# Altium project CP2102_USB-TO-UART.PrjPcb
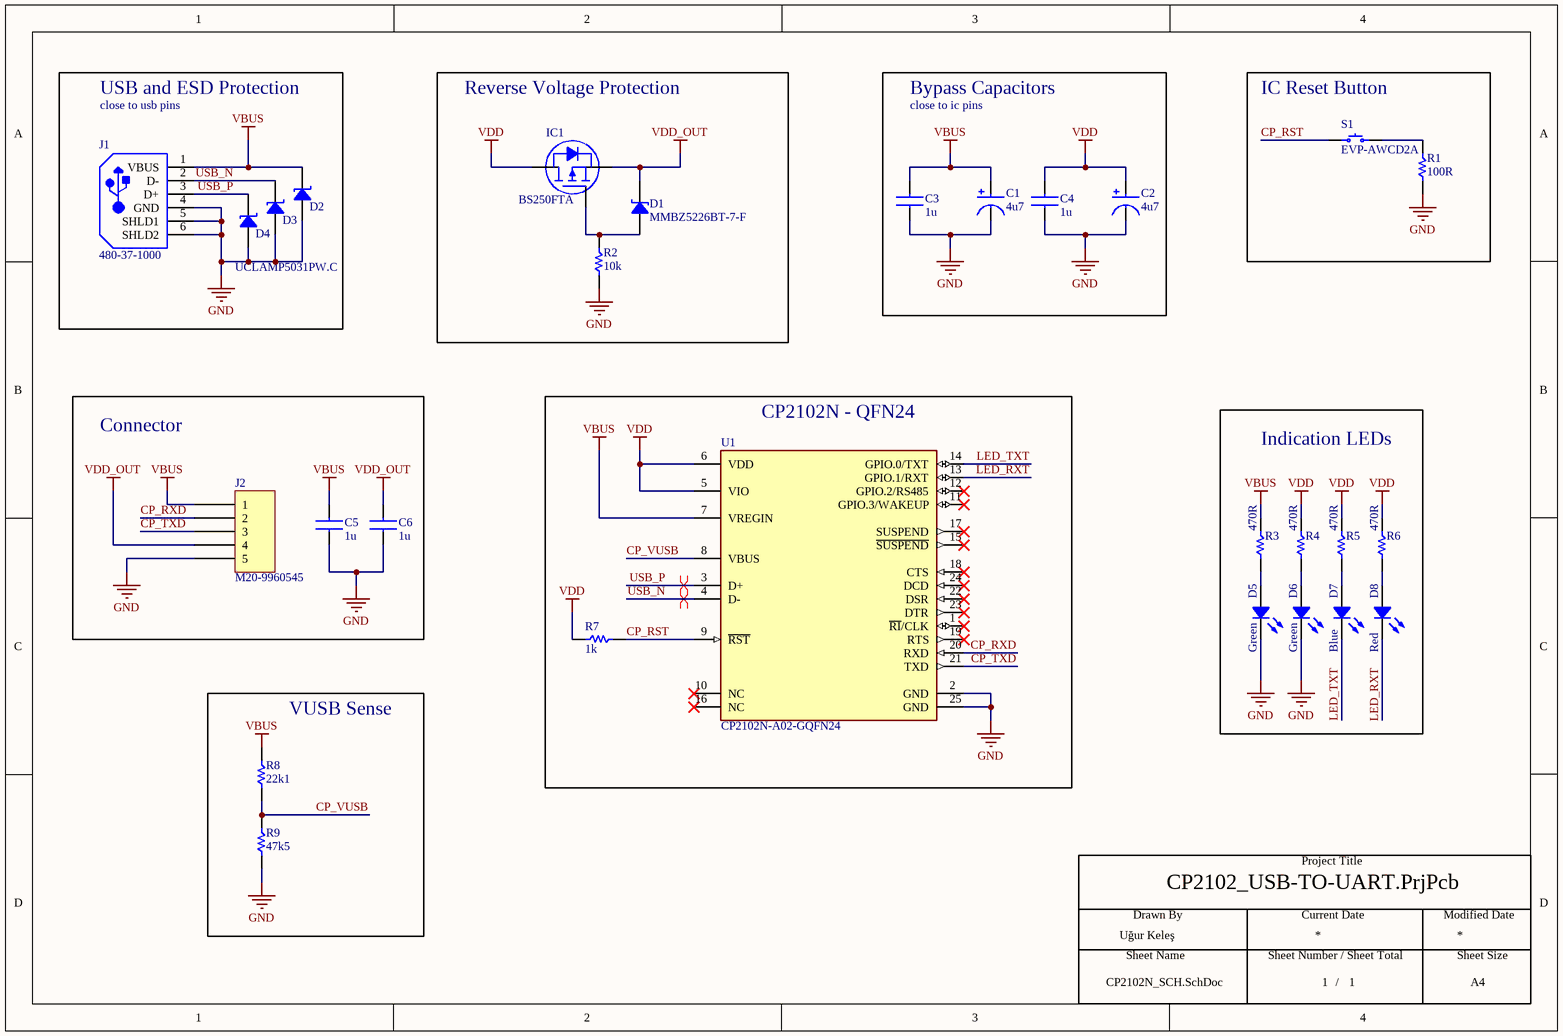
[diagram p0: CP2102N_SCH.SchDoc]
1 sheet, 28 parts. Net scope: global (net labels, ports and power ports of the same name join across sheets).
Board file: CP2102N_PCB.PcbDoc

## Sheet CP2102N_SCH.SchDoc
size A4; DrawnBy: Uğur Keleş; SheetNumber: 1; SheetTotal: 1; Size: A4

### Parts
C1  4u7  [CAP TANT 0805]
C2  4u7  [CAP TANT 0805]
C3  1u  [CAP CER 0402]
C4  1u  [CAP CER 0402]
C5  1u  [CAP CER 0402]
C6  1u  [CAP CER 0402]
D1  MMBZ5226BT-7-F  [DIODES SOT-523]
D2  UCLAMP5031PW.C  [0402]  (value not drawn)
D3  UCLAMP5031PW.C  [0402]  (value not drawn)
D4  UCLAMP5031PW.C  [0402]
D5  Green  [LED 0402_1005 GREEN]
D6  Green  [LED 0402_1005 GREEN]
D7  Blue  [LED 0402_1005 BLUE]
D8  Red  [LED 0402_1005 RED]
IC1  BS250FTA  [DIODES SOT-23-3]
J1  480-37-1000  [MOLX-480-37-1000_V]
J2  M20-9960545  [HARWIN M20-9960545]
R1  100R  [Resistor 0402]
R2  10k  [Resistor 0402]
R3  470R  [Resistor 0402]
R4  470R  [Resistor 0402]
R5  470R  [Resistor 0402]
R6  470R  [Resistor 0402]
R7  1k  [Resistor 0402]
R8  22k1  [Resistor 0402]
R9  47k5  [Resistor 0402]
S1  EVP-AWCD2A  [PANASONIC EVPAW]
U1  CP2102N-A02-GQFN24  [FP-CP2102N-A02-GQFN24-MFG]

### Blocks framed on the sheet
USB and ESD Protection: D2-D4 J1
Reverse Voltage Protection: D1 IC1 R2
Bypass Capacitors: C1-C4
IC Reset Button: R1 S1
Connector: C5 C6 J2
CP2102N - QFN24: R7 U1
Indication LEDs: D5-D8 R3-R6
VUSB Sense: R8 R9

### Nets
GND: C1.2 C2.2 C3.1 C4.1 C5.1 C6.1 D2.1 D3.1 D4.1 D5.2 D6.2 J1.4(GND) J1.5(SHLD1) J1.6(SHLD2) J2.5 R1.1 R2.1 R9.1 U1.2(GND) U1.25(GND)
VBUS: C1.1 C3.2 C5.2 D2.2 J1.1(VBUS) J2.1 R3.2 R8.2 U1.7(VREGIN)
VDD: C2.1 C4.2 IC1.3(D) R4.2 R5.2 R6.2 R7.1 U1.5(VIO) U1.6(VDD)
VDD_OUT: C6.2 D1.2 IC1.2(S) J2.4
CP_RST: R7.2 S1.1 U1.9(~{RST})
CP_RXD: J2.2 U1.20(RXD)
CP_TXD: J2.3 U1.21(TXD)
CP_VUSB: R8.1 R9.2 U1.8(VBUS)
LED_RXT: D8.2 U1.13(GPIO.1/RXT)
LED_TXT: D7.2 U1.14(GPIO.0/TXT)
USB_N: D3.2 J1.2(D-) U1.4(D-)
USB_P: D4.2 J1.3(D+) U1.3(D+)
NetD1_1: D1.1 IC1.1(G) R2.2
NetD5_1: D5.1 R3.1
NetD6_1: D6.1 R4.1
NetD7_1: D7.1 R5.1
NetD8_1: D8.1 R6.1
NetR1_2: R1.2 S1.2

Not connected (* = marked no-connect by the designer): U1 1(~{RI}/CLK)* 10(NC)* 11(GPIO.3/WAKEUP)* 12(GPIO.2/RS485)* 15(~{SUSPEND})* 16(NC)* 17(SUSPEND)* 18(CTS)* 19(RTS)* 22(DSR)* 23(DTR)* 24(DCD)*

### Layout directives
differential pair: USB_N, USB_P

### Notes on the sheet
- close to usb pins
- close to ic pins
- Drawn By
- Project Title
- Current Date
- Modified Date
- Sheet Name
- Sheet Number / Sheet Total
- /
- Sheet Size

### Library data of the parts
C1 C2 = CAP TANT GENERIC 0805: Designed by: UK; Value: 4u7
C3-C6 = CAP CER GENERIC 0402: Designed by: UK; Value: 1u
D1 = MMBZ5226BT-7-F: DIODE ZENER 3.3V 150MW SOT523; Manufacturer: Diodes Incorporated; Current - Reverse Leakage @ Vr: 25 µA @ 1 V; Impedance (Max) (Zzt): 28 Ohms; Tolerance: ±5%; Voltage - Forward (Vf) (Max) @ If: 900 mV @ 10 mA; Part Number: MMBZ5226BT-7-F; ComponentLink1Description: Datasheet; ComponentLink1URL: https://www.diodes.com/assets/Datasheets/ds30267.pdf; ComponentLink2Description: DigiKey Link; ComponentLink2URL: https://www.digikey.com/en/products/detail/diodes-incorporated/MMBZ5226BT-7-F/2095654; LastUpdated: 6/3/2024 8:01:51 PM; Lifecycle Status: Active; Minimum Order: 1; Mounting Type: Surface Mount; Operating Temperature: -65°C ~ 150°C; Package / Case: SOT-523; Packaging: TapeAndReel; PartId: 790; Part Status: Active; Power - Max: 150 mW; Price: 0.05; Series: -; Supplier 1: DigiKey; Supplier Part Number 1: MMBZ5226BTDICT-ND; Supplier Device Package: SOT-523; Voltage - Zener (Nom) (Vz): 3.3 V
D2-D4 = UCLAMP5031PW.C: 5V ESD & EOS PROTECTION; Manufacturer: Semtech Corporation; Power Line Protection: No; Type: Zener; Unidirectional Channels: 1; Part Number: UCLAMP5031PW.C; Applications: General Purpose; ComponentLink2Description: DigiKey Link; ComponentLink2URL: https://www.digikey.com/en/products/detail/semtech-corporation/UCLAMP5031PW-C/21371847; Device Package: 0402 (1005 Metric); LastUpdated: 6/3/2024 8:22:49 PM; Lifecycle Status: Active; Minimum Order: 1; Mounting Type: Surface Mount; Package / Case: 0402 (1005 Metric); Packaging: TapeAndReel; PartId: 11945; Price: 0.08; Series: uClamp®; Supplier 1: DigiKey; Supplier Part Number 1: 600-UCLAMP5031PW.CCT-ND; Supplier Device Package: 2-DFN (1x0.6); Voltage - Reverse Standoff (Typ): 5V
D5 D6 = QBLP595-AG15: LED GREEN CLEAR 0402 SMD; Manufacturer: QT Brightek (QTB); Configuration: Standard; Current - Test: 5mA; Lens Color: Colorless; Lens Size: 0.70mm x 0.50mm; Lens Style: Rectangle with Flat Top; Millicandela Rating: 9.5mcd; Viewing Angle: 140°; Voltage - Forward (Vf) (Typ): 1.9V; Wavelength - Dominant: 570nm; Part Number: QBLP595-AG15; Color: Green; ComponentLink1Description: Datasheet; ComponentLink1URL: https://www.qt-brightek.com/datasheet/QBLP595-AG15.pdf; ComponentLink2Description: DigiKey Link; ComponentLink2URL: https://www.digikey.com/en/products/detail/qt-brightek-qtb/QBLP595-AG15/17048989; Device Package: 0402 (1005 Metric); Height (Max): 0.60mm; LastUpdated: 6/3/2024 7:58:13 PM; Lens Transparency: Clear; Lifecycle Status: Active; Minimum Order: 1; Mounting Type: Surface Mount; Package / Case: 0402 (1005 Metric); Packaging: TapeAndReel; PartId: 1263; Part Status: Active; Price: 0.05; Series: QBLP595; Size / Dimension: 1.00mm L x 0.50mm W; Supplier 1: DigiKey; Supplier Part Number 1: 1516-QBLP595-AG15CT-ND; Supplier Device Package: 0402; Value: Green
D7 = QBLP595-IB5: LED BLUE CLEAR 0402 SMD; Manufacturer: QT Brightek (QTB); Configuration: Standard; Current - Test: 5mA; Lens Color: Colorless; Lens Size: 0.70mm x 0.50mm; Lens Style: Rectangle with Flat Top; Millicandela Rating: 38mcd; Viewing Angle: 140°; Voltage - Forward (Vf) (Typ): 2.7V; Wavelength - Dominant: 470nm; Part Number: QBLP595-IB5; Color: Blue; ComponentLink1Description: Datasheet; ComponentLink1URL: https://www.qt-brightek.com/datasheet/QBLP595-IB5.pdf; ComponentLink2Description: DigiKey Link; ComponentLink2URL: https://www.digikey.com/en/products/detail/qt-brightek-qtb/QBLP595-IB5/17049838; Device Package: 0402 (1005 Metric); Height (Max): 0.60mm; LastUpdated: 6/3/2024 7:57:31 PM; Lens Transparency: Clear; Lifecycle Status: Active; Minimum Order: 1; Mounting Type: Surface Mount; Package / Case: 0402 (1005 Metric); Packaging: TapeAndReel; PartId: 1260; Part Status: Active; Price: 0.05; Series: QBLP595; Size / Dimension: 1.00mm L x 0.50mm W; Supplier 1: DigiKey; Supplier Part Number 1: 1516-QBLP595-IB5CT-ND; Supplier Device Package: 0402; Value: Blue
D8 = QBLP595-R5-2897: LED RED CLEAR 0402 SMD; Manufacturer: QT Brightek (QTB); Configuration: Standard; Current - Test: 5mA; Lens Color: Colorless; Lens Size: 0.70mm x 0.50mm; Lens Style: Rectangle with Flat Top; Millicandela Rating: 95mcd; Viewing Angle: 140°; Voltage - Forward (Vf) (Typ): 1.85V; Wavelength - Dominant: 622nm; Part Number: QBLP595-R5-2897; Color: Red; ComponentLink1Description: Datasheet; ComponentLink1URL: https://www.qt-brightek.com/datasheet/QBLP595-R5-2897.pdf; ComponentLink2Description: DigiKey Link; ComponentLink2URL: https://www.digikey.com/en/products/detail/qt-brightek-qtb/QBLP595-R5-2897/17048972; Device Package: 0402 (1005 Metric); Height (Max): 0.60mm; LastUpdated: 6/3/2024 7:59:16 PM; Lens Transparency: Clear; Lifecycle Status: Active; Minimum Order: 1; Mounting Type: Surface Mount; Package / Case: 0402 (1005 Metric); Packaging: TapeAndReel; PartId: 1266; Part Status: Active; Price: 0.05; Series: QBLP595; Size / Dimension: 1.00mm L x 0.50mm W; Supplier 1: DigiKey; Supplier Part Number 1: 1516-QBLP595-R5-2897CT-ND; Supplier Device Package: 0402; Value: Red
IC1 = BS250FTA: MOSFET P-CH 45V 90MA SOT23-3; Manufacturer: Diodes Incorporated; Current - Continuous Drain (Id) @ 25°C: 90mA (Ta); Drive Voltage (Max Rds On,  Min Rds On): 10V; FET Type: P-Channel; Input Capacitance (Ciss) (Max) @ Vds: 25 pF @ 10 V; Power Dissipation (Max): 330mW (Ta); Rds On (Max) @ Id, Vgs: 14Ohm @ 200mA, 10V; Vgs (Max): ±20V; Vgs(th) (Max) @ Id: 3.5V @ 1mA; Part Number: BS250FTA; ComponentLink1Description: Datasheet; ComponentLink1URL: https://www.diodes.com/assets/Datasheets/BS250F.pdf; ComponentLink2Description: DigiKey Link; ComponentLink2URL: https://www.digikey.com/en/products/detail/diodes-incorporated/BS250FTA/58819; Drain to Source Voltage (Vdss): 45 V; LastUpdated: 6/3/2024 8:15:20 PM; Lifecycle Status: Active; Minimum Order: 1; Mounting Type: Surface Mount; Operating Temperature: -55°C ~ 150°C (TJ); Package / Case: TO-236-3, SC-59, SOT-23-3; Packaging: TapeAndReel; Part Status: Active; Price: 0.22; Series: -; Supplier 1: DigiKey; Supplier Part Number 1: BS250FCT-ND; Supplier Device Package: SOT-23-3; Technology: MOSFET (Metal Oxide)
J1 = CMP-1676-00005-2: Universal Serial Bus (USB) Shielded I/O Plug, Type A, Right Angle Connector, 1.5 A, -20 to 85 degC, 4-Pin SMD, RoHS, Tray; Voltage Rating (DC): 50 V; Tolerance: 1%; Resistance: 1 mohm; Power Rating: 100 mW; Case\Package: 0603; PackageDescription: 4-Pin Surface Mount Device, Body 12 x 18.8 mm; Max Operating Temperature: 155 degC; PackageReference: 480-37-1000; ComponentLink2Description: Datasheet; ComponentLink1Description: Manufacturer URL; Packaging: Tape and Reel; REACH SVHC: No SVHC; Width: 0.8 mm; Case Code (Imperial): 0603; Pins: 2; Length: 1.6 mm; DatasheetVersion: Rev. D, 06/2004; Voltage Rating: 50 V; ComponentLink1URL: http://www.molex.com/; Mount: Surface Mount; Case Code (Metric): 1608; ComponentLink2URL: http://www.molex.com/pdm_docs/sd/480371000_sd.pdf; RoHSCompliant: true; Min Operating Temperature: -55 degC; Package Quantity: 5000; Height: 0.45 mm
J2 = M20-9960545: CONN HEADER R/A 5POS 2.54MM; Manufacturer: Harwin Inc.; Connector Type: Header, Cuttable; Contact Length - Mating: 0.240" (6.10mm); Contact Length - Post: 0.118" (3.00mm); Current Rating (Amps): 3A per Contact; Material Flammability Rating: UL94 V-0; Number of Positions: 5; Number of Positions Loaded: All; Pitch - Mating: 0.100" (2.54mm); Row Spacing - Mating: -40°C ~ 105°C; Shrouding: Unshrouded; Style: Board to Board or Cable; Part Number: M20-9960545; ComponentLink1Description: Datasheet; ComponentLink1URL: https://cdn.harwin.com/pdfs/Harwin_PC_Connectors_M20.pdf; ComponentLink2Description: DigiKey Link; ComponentLink2URL: https://www.digikey.com/en/products/detail/harwin-inc/M20-9960545/3728210; Contact Finish - Mating: Gold; Contact Material: Brass; Contact Shape: Square; Contact Type: Male Pin; Fastening Type: Push-Pull; Insulation Color: Black; Insulation Height: 0.100" (2.54mm); Insulation Material: Polyamide (PA6T), Nylon 6T; LastUpdated: 9/21/2022 7:23:36 PM; Lifecycle Status: Active; Minimum Order: 1; Mounting Type: Through Hole, Right Angle; Number of Rows: 1; Operating Temperature: -40°C ~ 105°C; Packaging: Bulk; PartId: 168; Part Status: Active; Price: 0.14; Series: M20; Supplier 1: DigiKey; Supplier Part Number 1: 952-2246-ND; Termination: Solder
R1-R9 = RES 0402: SMD Chip Resistor, 0402 [1005 Metric], Thick Film, General Purpose; Designed by: UK
  R1: Value: 100R
  R2: Value: 10k
  R3-R6: Value: 470R
  R7: Value: 1k
  R8: Value: 22k1
  R9: Value: 47k5
S1 = EVP-AWCD2A: SWITCH TACTILE SPST-NO 0.02A 15V; Manufacturer: Panasonic Electronic Components; Actuator Height off PCB, Vertical: 0.60mm; Actuator Orientation: Top Actuated; Actuator Type: Standard; Contact Rating @ Voltage: 0.02A @ 15VDC; Illumination: Non-Illuminated; Ingress Protection: IP67 - Dust Tight, Waterproof; Operating Force: 240gf; Outline: 3.00mm x 2.00mm; Switch Function: Off-Mom; Part Number: EVP-AWCD2A; Circuit: SPST-NO; ComponentLink1Description: Datasheet; ComponentLink1URL: //media.digikey.com/pdf/Data%20Sheets/Panasonic%20Electronic%20Components/EVPAW.pdf; ComponentLink2Description: DigiKey Link; ComponentLink2URL: https://www.digikey.com/en/products/detail/panasonic-electronic-components/EVP-AWCD2A/6125103; LastUpdated: 6/3/2024 8:19:31 PM; Lifecycle Status: Active; Minimum Order: 1; Mounting Type: Surface Mount; Operating Temperature: -40°C ~ 85°C; Packaging: TapeAndReel; Part Status: Active; Price: 0.30; Series: EVPAW; Supplier 1: DigiKey; Supplier Part Number 1: P19744CT-ND; Termination Style: SMD (SMT) Tab
U1 = CMP-08107-000010-1: IC USB TO UART BRIDGE QFN24